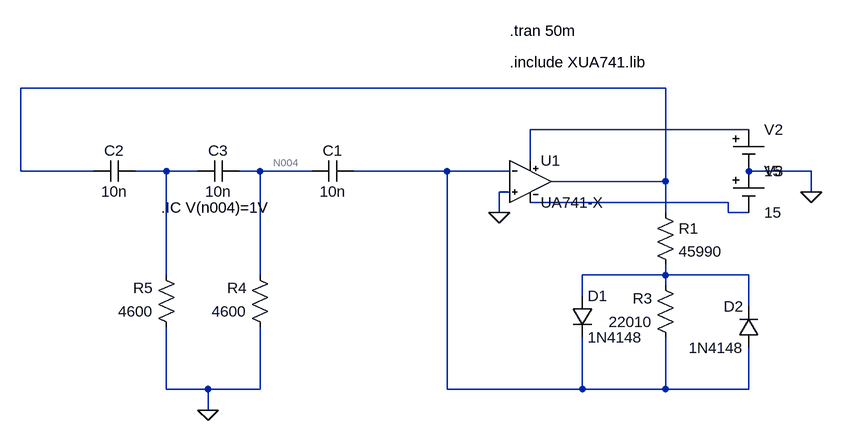
[diagram p0: schematic Alt-Ph-Shift-Osc.asc]
Alt-Ph-Shift-Osc.asc, the LTspice schematic file:
Version 4
SHEET 1 880 680
WIRE 400 32 -592 32
WIRE 528 96 192 96
WIRE 192 144 192 96
WIRE -592 160 -592 32
WIRE -480 160 -592 160
WIRE -368 160 -416 160
WIRE -320 160 -368 160
WIRE -224 160 -256 160
WIRE -144 160 -224 160
WIRE 64 160 -80 160
WIRE 160 160 64 160
WIRE 624 160 528 160
WIRE 400 176 400 32
WIRE 400 176 224 176
WIRE 160 192 144 192
WIRE 624 192 624 160
WIRE 496 208 192 208
WIRE 144 224 144 192
WIRE 400 224 400 176
WIRE 496 224 496 208
WIRE 528 224 496 224
WIRE -368 320 -368 160
WIRE -224 320 -224 160
WIRE 400 320 400 304
WIRE 400 320 272 320
WIRE 528 320 400 320
WIRE 400 336 400 320
WIRE 272 352 272 320
WIRE 528 368 528 320
WIRE -368 496 -368 400
WIRE -304 496 -368 496
WIRE -224 496 -224 400
WIRE -224 496 -304 496
WIRE 64 496 64 160
WIRE 272 496 272 416
WIRE 272 496 64 496
WIRE 400 496 400 416
WIRE 400 496 272 496
WIRE 528 496 528 432
WIRE 528 496 400 496
WIRE -304 528 -304 496
FLAG 144 224 0
FLAG 624 192 0
FLAG -304 528 0
SYMBOL res 384 208 R0
SYMATTR InstName R1
SYMATTR Value 45990
SYMBOL cell 528 96 R0
SYMATTR InstName V2
SYMATTR Value 15
SYMBOL cell 528 160 R0
SYMATTR InstName V3
SYMATTR Value 15
SYMBOL XUA741 192 112 R0
SYMATTR InstName U1
SYMBOL res 416 432 R180
WINDOW 0 36 76 Left 2
WINDOW 3 36 40 Left 2
SYMATTR InstName R3
SYMATTR Value 22010
SYMBOL res -208 416 R180
WINDOW 0 36 76 Left 2
WINDOW 3 36 40 Left 2
SYMATTR InstName R4
SYMATTR Value 4600
SYMBOL res -352 416 R180
WINDOW 0 36 76 Left 2
WINDOW 3 36 40 Left 2
SYMATTR InstName R5
SYMATTR Value 4600
SYMBOL cap -80 144 R90
WINDOW 0 0 32 VBottom 2
WINDOW 3 32 32 VTop 2
SYMATTR InstName C1
SYMATTR Value 10n
SYMBOL cap -416 144 R90
WINDOW 0 0 32 VBottom 2
WINDOW 3 32 32 VTop 2
SYMATTR InstName C2
SYMATTR Value 10n
SYMBOL cap -256 144 R90
WINDOW 0 0 32 VBottom 2
WINDOW 3 32 32 VTop 2
SYMATTR InstName C3
SYMATTR Value 10n
SYMBOL diode 256 352 R0
SYMATTR InstName D1
SYMATTR Value 1N4148
SYMBOL diode 544 432 R180
WINDOW 0 24 64 Left 2
WINDOW 3 24 0 Left 2
SYMATTR InstName D2
SYMATTR Value 1N4148
TEXT 160 -56 Left 2 !.tran 50m
TEXT 160 -8 Left 2 !.include XUA741.lib
TEXT -376 216 Left 2 !.IC V(n004)=1V

The netlist it stands for:
* Alt-Ph-Shift-Osc.asc
R1 N001 N007 45990
V2 N002 0 15
V3 0 N006 15
XU1 0 N005 N002 N006 N001 UA741-X  ; pins In+ In- V+ V- OUT
R3 N005 N007 22010
R4 0 N004 4600
R5 0 N003 4600
C1 N005 N004 10n
C2 N003 N001 10n
C3 N004 N003 10n
D1 N007 N005 1N4148
D2 N005 N007 1N4148
.model D D
.lib standard.dio
.tran 50m
.include XUA741.lib
.IC V(n004)=1V
.lib XUA741.lib
.backanno
.end